# EAGLE design Esquematico cargador simple (EAGLE 9.6.2)
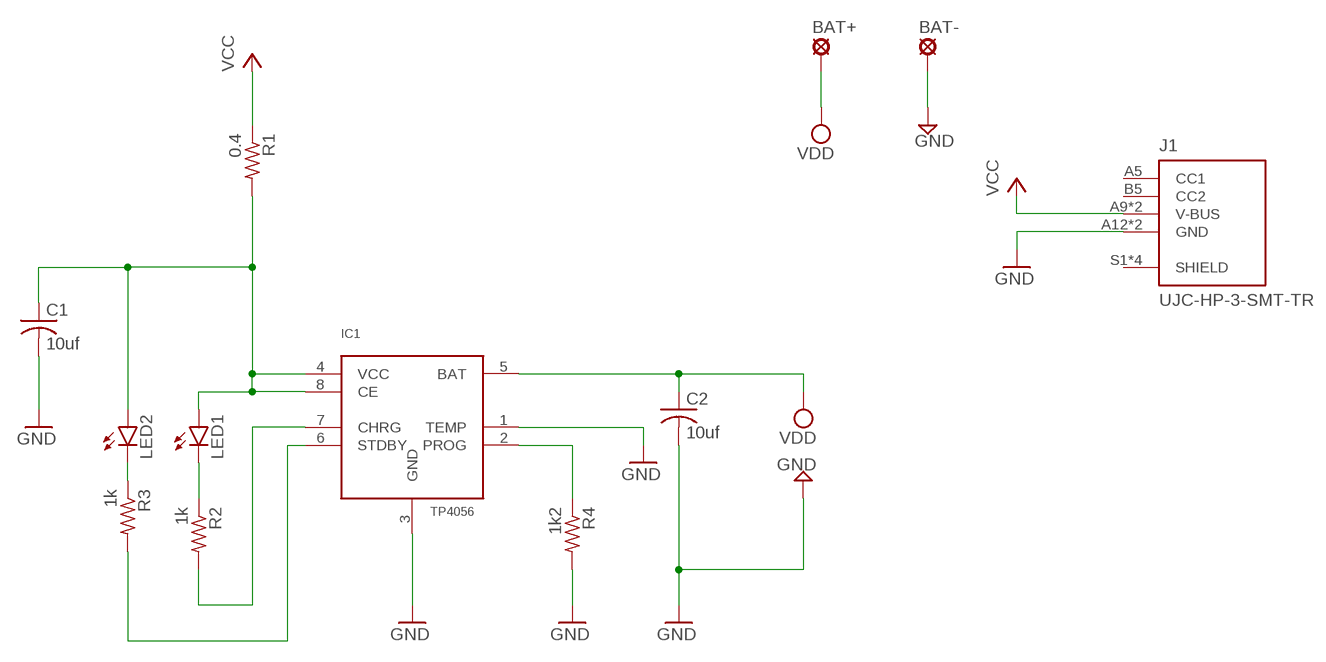
[diagram p0: schematic, sheet 1]

## Parts
BAT+  LSP10  [LSP10]
BAT-  LSP10  [LSP10]
C1  10uf  C-USC1206  [C1206]
C2  10uf  C-USC1206  [C1206]
IC1  TP4056  [SOP-8]
J1  UJC-HP-3-SMT-TR  [CUI_UJC-HP-3-SMT-TR]
LED1  LEDSML1206  [SML1206]
LED2  LEDSML1206  [SML1206]
R1  0.4  R-US_R1206  [R1206]
R2  1k  R-US_R1206  [R1206]
R3  1k  R-US_R1206  [R1206]
R4  1k2  R-US_R1206  [R1206]

## Nets
GND: BAT-.MP C1.2 C2.2 IC1.1(TEMP) IC1.3(GND) J1.A12(GND) J1.B12(GND) R4.2
N$1: C1.1 IC1.4(VCC) IC1.8(CE) LED1.A LED2.A R1.2
N$2: IC1.2(PROG) R4.1
N$3: LED1.C R2.1
N$4: IC1.7(CHRG) R2.2
N$5: LED2.C R3.1
N$6: IC1.6(STDBY) R3.2
VCC: J1.A9(V-BUS) J1.B9(V-BUS) R1.1
VDD: BAT+.MP C2.1 IC1.5(BAT)
Unconnected: J1.A5(CC1) J1.B5(CC2) J1.S1(SHIELD) J1.S2(SHIELD) J1.S3(SHIELD) J1.S4(SHIELD)

## Library data of the parts
BAT+ BAT- = solpad:LSP10: SOLDER PAD drill 1.0 mm, distributor Buerklin, 12H555
C1 C2 = rcl:C-US: CAPACITOR, American symbol; SPICEPREFIX: C
IC1 = TP4056:TP4056; AVAILABILITY: Unavailable; DESCRIPTION: Complete single cell Li-Ion battery with a constant current / constant voltage linear charger; MF: NanJing Top Power ASIC Corp.; MP: TP4056; PACKAGE: Package; PRICE: None
J1 = UJC-HP-3-SMT-TR:UJC-HP-3-SMT-TR: USB RECEPTACLE Check prices <https://pricing.snapeda.com/parts/UJC-HP-3-SMT-TR/CUI%20Devices/view-part?ref=eda>; AVAILABILITY: Good; CUI_PURCHASE_URL: https://www.cuidevices.com/product/interconnect/connectors/usb-connectors/ujc-hp-3-smt-tr?utm_source=snapeda.com&utm_medium=referral&utm_campaign=snapedaBOM; DESCRIPTION: Type C, 3 A, Right Angle, Surface Mount (SMT), Power-Only USB Receptacle; MF: CUI Devices; MP: UJC-HP-3-SMT-TR; PACKAGE: Package; PRICE: None; PURCHASE-URL: https://pricing.snapeda.com/search/part/UJC-HP-3-SMT-TR/?ref=eda
LED1 LED2 = led:LED: LED OSRAM: - CHIPLED LG R971, LG N971, LY N971, LG Q971, LY Q971, LO R971, LY R971 LH N974, LH R974 LS Q976, LO Q976, LY Q976 LO Q996 - Hyper CHIPLED LW Q18S LB Q993, LB Q99A, LB R99A - SideLED LS A670, LO A670, LY A670, LG A670, LP A670 LB A673, LV A673, LT A673, LW A673 LH A674 LY A675 LS A676, LA A676, LO A676, LY A676, LW A676 LS A679, LY A679, LG A679 - Hyper Micro SIDELED® LS Y876, LA Y876, LO Y876, LY Y876 LT Y87S - SmartLED LW L88C, LW L88S LB L89C, LB L89S, LG L890 LS L89K, LO L89K, LY L89K LS L896, LA L896, LO L896, LY L896 - TOPLED LS T670, LO T670, LY T670, LG T670, LP T670 LSG T670, LSP T670, LSY T670, LOP T670, LYG T670 LG T671, LOG T671, LSG T671 LB T673, LV T673, LT T673, LW T673 LH T674 LS T676, LA T676, LO T676, LY T676, LB T676, LH T676, LSB T676, LW T676 LB T67C, LV T67C, LT T67C, LS T67K, LO T67K, LY T67K, LW E67C LS E67B, LA E67B, LO E67B, LY E67B, LB E67C, LV E67C, LT E67C LW T67C LS T679, LY T679, LG T679 LS T770, LO T770, LY T770, LG T770, LP T770 LB T773, LV T773, LT T773, LW T773 LH T774 LS E675, LA E675, LY E675, LS T675 LS T776, LA T776, LO T776, LY T776, LB T776 LHGB T686 LT T68C, LB T68C - Hyper Mini TOPLED® LB M676 - Mini TOPLED Santana® LG M470 LS M47K, LO M47K, LY M47K Source: http://www.osram.convergy.de LUXEON: - LUMILED® LXK2-PW12-R00, LXK2-PW12-S00, LXK2-PW14-U00, LXK2-PW14-V00 LXK2-PM12-R00, LXK2-PM12-S00, LXK2-PM14-U00 LXK2-PE12-Q00, LXK2-PE12-R00, LXK2-PE12-S00, LXK2-PE14-T00, LXK2-PE14-U00 LXK2-PB12-K00, LXK2-PB12-L00, LXK2-PB12-M00, LXK2-PB14-N00, LXK2-PB14-P00, LXK2-PB14-Q00 LXK2-PR12-L00, LXK2-PR12-M00, LXK2-PR14-Q00, LXK2-PR14-R00 LXK2-PD12-Q00, LXK2-PD12-R00, LXK2-PD12-S00 LXK2-PH12-R00, LXK2-PH12-S00 LXK2-PL12-P00, LXK2-PL12-Q00, LXK2-PL12-R00 Source: www.luxeon.com KINGBRIGHT: KA-3528ASYC Source: www.kingbright.com
R1-R4 = rcl:R-US_: RESISTOR, American symbol; SPICEPREFIX: R

## Board
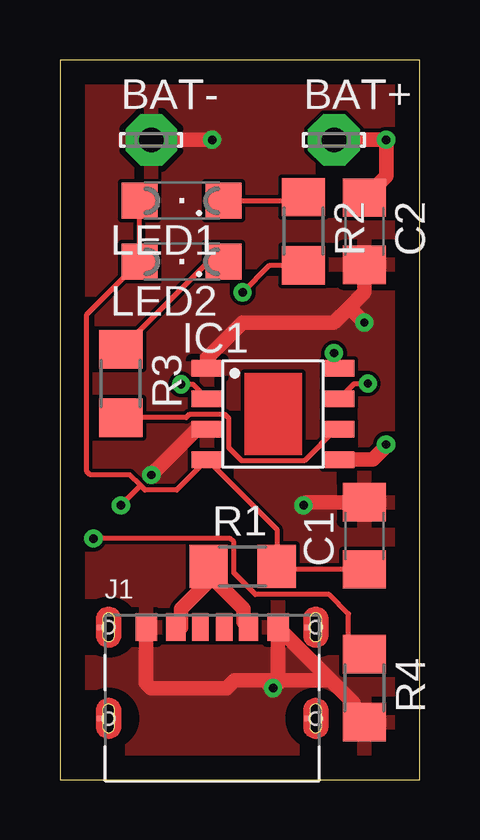
[diagram p1: board, top side]
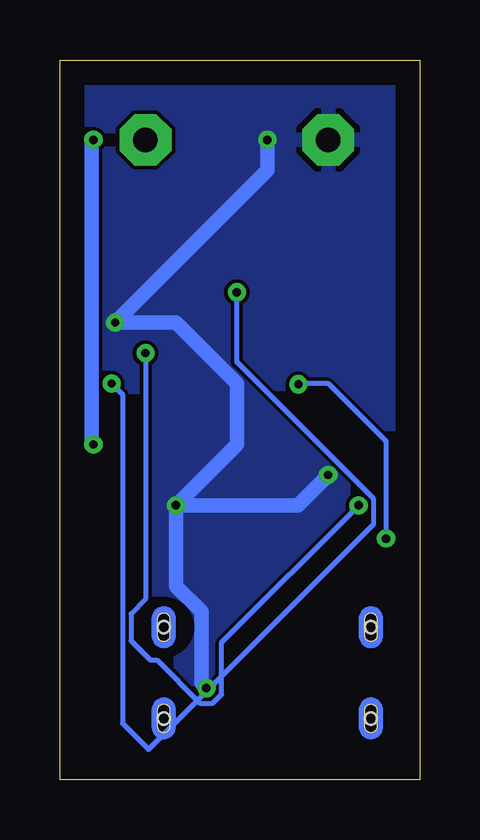
[diagram p2: board, bottom side, seen from below]

Size 15 x 30 mm. Coordinates in mm from the lower left corner, seen from the top.
Outline: 0,0 15,0 15,30 0,30 0,0
Copper layers (1*16): Top 0.035mm / dielectric 1.5mm / Bottom 0.035mm
Design rules "default": minimum track width 6mil, minimum drill 0.35mm, track to track 6mil, track to pad 6mil, pad to pad 6mil, via to via 6mil, smd to smd 6mil, copper to edge 40mil, drill to drill 6mil, minimum pad ring 10mil, minimum via ring 8mil, stop-mask expansion 4mil, vias tented up to drill 0mil, thermal gap 10mil

### Footprints (pad centres in the part's own frame; a part is rotated, then mirrored left to right if it is on the bottom)
LSP10 = drill 1.016 pad 2.159 octagon: MP 0,0
C1206 = smd 1.6 x 1.8: 1 -1.4,0; 2 1.4,0
SOP-8 = smd 1.3 x 0.7: 1 -2.75,1.905; 2 -2.75,0.635; 3 -2.75,-0.635; 4 -2.75,-1.905; 5 2.75,-1.905; 6 2.75,-0.635; 7 2.75,0.635; 8 2.75,1.905
CUI_UJC-HP-3-SMT-TR = smd 0.7 x 1.15: A5 -0.5,0; B5 0.5,0 | smd 0.8 x 1.15: A9 1.52,0; B9 -1.52,0 | smd 0.9 x 1.15: A12 2.75,0; B12 -2.75,0 | smd 0.2 x 0.2: S1 -4.695,0; S2 3.945,0; S3 -4.695,-3.8; S4 3.945,-3.8 | hole 0.5: -4.32,0; 4.32,0; -4.32,-3.8; 4.32,-3.8
SML1206 = smd 1.5 x 1.5: A 1.75,0; C -1.75,0
R1206 = smd 1.6 x 1.803: 1 -1.422,0; 2 1.422,0

### Placement (x,y rotation side)
BAT+  11.43,26.67 0 top
BAT-  3.81,26.67 0 top
C1  12.7,10.16 90 top
C2  12.7,22.86 270 top
IC1  8.89,15.24 0 top
J1  6.35,6.35 0 top
LED1  5.08,24.13 180 top
LED2  5.08,21.59 180 top
R1  7.62,8.89 0 top
R2  10.16,22.86 270 top
R3  2.54,16.51 270 top
R4  12.7,3.81 270 top

### Tracks (layer width: path | path; a pad name or v marks a point on that pad's centre or on a via)
GND  (via drill 0.35)
  Top 0.61: 9.1,5.99 J1.A12 11.3,4.14 | J1.B12 3.6,4.02 3.81,3.81 6.95,3.81 7.29,4.14 8.56,4.14 | J1.A12 9.1,5.7 9.1,5.08 9.1,4.02 v8.89,3.81 8.56,4.14 | v10.16,11.43 10.29,11.56 C1.2 | IC1.1 6.14,17.57 7.62,19.05 11.43,19.05 12.06,19.68 | 12.06,19.68 12.7,20.32 C2.2 | 12.06,19.68 v12.7,19.05 | v6.35,26.67 BAT-.MP | IC1.3 5.71,14.61 v3.81,12.7 | R4.2 12.24,2.85 12.24,3.2 11.3,4.14 | 11.3,4.14 8.56,4.14
  Bottom 0.61: v8.89,3.81 9.1,4.02 9.1,7 10.16,8.06 v10.16,11.43 | v10.16,11.43 7.62,13.97 7.62,16.51 10.16,19.05 v12.7,19.05 6.35,25.4 v6.35,26.67 | v3.81,12.7 5.08,11.43 v10.16,11.43
  pour Top: 15.24,0 15.24,30.48 0,30.48 0,0
  pour Bottom: 15.24,0 15.24,30.48 0,30.48 0,0
N$1  (via drill 0.35)
  Top 0.203: C1.1 9.17,8.76 R1.2 9.04,10.43 IC1.4 4.87,12.07 3.55,12.07 3.36,12.25 | 3.36,12.25 2.92,12.7 1.27,12.7 1.12,12.85 1.12,19.38 LED2.A LED1.A | IC1.8 11.43,17.36 v11.43,17.78 | v2.54,11.43 3.36,12.25
  Bottom 0.203: v11.43,17.78 11.43,7.52 12.04,6.92 12.04,5.78 11.24,4.98 10.96,4.98 9.15,3.18 8.63,3.18 8.26,3.55 8.26,5.71 v2.54,11.43
N$2  (via drill 0.35)
  Top 0.203: R4.1 12.04,5.89 12.04,6.92 11.24,7.72 8.15,7.72 7.25,8.62 7.25,9.9 7.1,10.05 v1.39,10.05 | v5.05,16.48 5.53,16.48 IC1.2
  Bottom 0.203: v1.39,10.05 1.39,14.09 3.81,16.51 5.03,16.51 v5.05,16.48
N$3
  Top 0.203: LED1.C 10.01,24.13 R2.1
N$4  (via drill 0.35)
  Top 0.203: IC1.7 12.28,16.51 v12.84,16.51 | v7.62,20.31 8.75,21.44 R2.2
  Bottom 0.203: v12.84,16.51 12.39,16.06 12.39,2.34 11.3,1.25 1.91,10.65 1.91,11.69 7.62,17.4 v7.62,20.31 v7.62,20.32
N$5
  Top 0.203: R3.1 6.2,21.59 LED2.C
N$6
  Top 0.203: IC1.6 11.52,14.61 10.2,13.29 7.58,13.29 7.04,13.83 7.04,15.06 6.89,15.21 5.38,15.21 5.26,15.09 R3.2
VCC
  Top 0.61: J1.B9 5.04,6.35 5.04,7.11 6.2,8.27 R1.1 6.2,8.57 7.66,7.11 7.66,6.56 J1.A9
VDD  (via drill 0.35)
  Top 0.61: IC1.5 13.04,13.34 13.68,13.97 v13.61,13.97 | C2.1 13.61,25.17 v13.61,26.67 BAT+.MP
  Bottom 0.61: v13.61,13.97 13.68,14.04 13.68,26.67 v13.61,26.67